# Altium project FX.PrjPcb
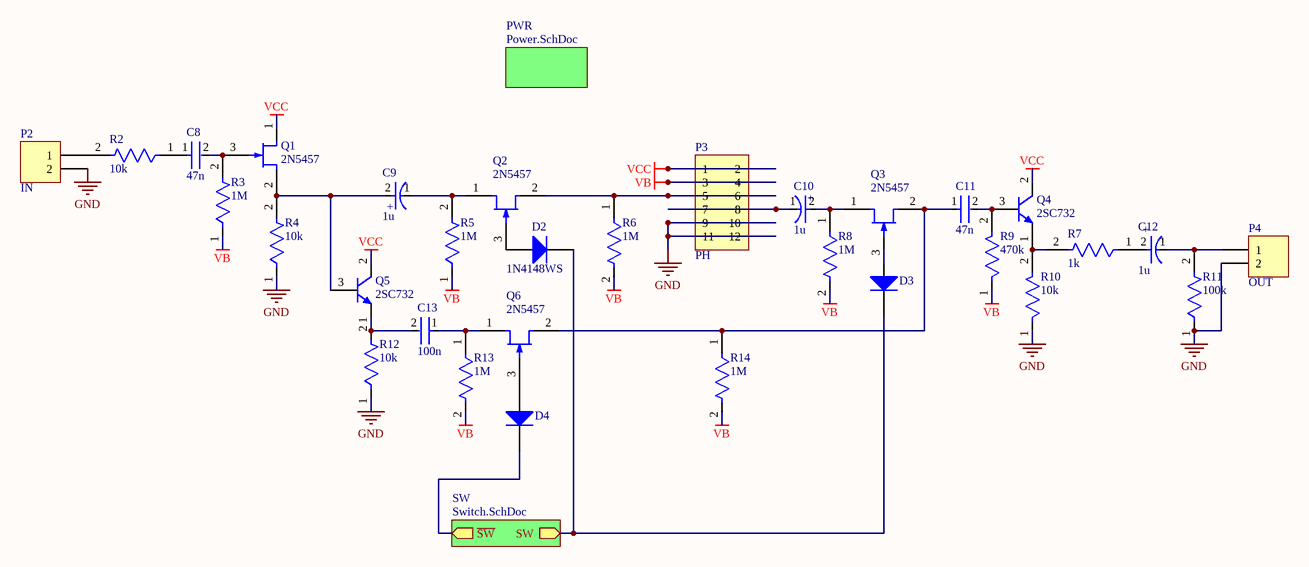
[diagram p0: Top_Level.SchDoc]
3 sheets, 72 parts. Net scope: hierarchical (ports join the sheet entries above them; power ports are global).
Board file: FX.PcbDoc
Sheets:
  Top_Level.SchDoc
    PWR = Power.SchDoc
    SW = Switch.SchDoc

## Sheet Top_Level.SchDoc
size A4

### Parts
C8  47n  [FP-CL10-IPC_A]
C9  1u  [FP-TAJA-MFG]
C10  1u  [FP-TAJA-MFG]
C11  47n  [FP-CL10-IPC_A]
C12  1u  [FP-TAJA-MFG]
C13  100n  [FP-CL10-IPC_A]
D2  1N4148WS  [DIOD-SOD323-2-A_V]
D3  1N4148WS  [DIOD-SOD323-2-A_V]  (value not drawn)
D4  1N4148WS  [DIOD-SOD323-2-A_V]  (value not drawn)
P2  IN  [HDR1X2]
P3  PH  [HDR2X6]
P4  OUT  [HDR1X2]
Q1  2N5457  [TO-92]
Q2  2N5457  [TO-92]
Q3  2N5457  [TO-92]
Q4  2SC732  [TO-92]
Q5  2SC732  [TO-92]
Q6  2N5457  [TO-92]
R2  10k  [FP-RT0805-MFG]
R3  1M  [FP-RT0805-MFG]
R4  10k  [FP-RT0805-MFG]
R5  1M  [FP-RT0805-MFG]
R6  1M  [FP-RT0805-MFG]
R7  1k  [FP-RT0805-MFG]
R8  1M  [FP-RT0805-MFG]
R9  470k  [FP-RT0805-MFG]
R10  10k  [FP-RT0805-MFG]
R11  100k  [FP-RT0805-MFG]
R12  10k  [FP-RT0805-MFG]
R13  1M  [FP-RT0805-MFG]
R14  1M  [FP-RT0805-MFG]

### Sub-sheets
PWR = Power.SchDoc: no entries
SW = Switch.SchDoc: ~{SW} (out), SW (out)

### Nets
GND: P2.2 P3.9 P3.10 P3.11 P3.12 P4.2 R4.1 R10.1 R11.1 R12.1
VB: P3.3 P3.4 R3.1 R5.1 R6.2 R8.2 R9.1 R13.2 R14.2
VCC: P3.1 P3.2 Q1.1(D) Q4.2(C) Q5.2(C)
NetC8_1: C8.1 R2.1
NetC8_2: C8.2 Q1.3(G) R3.2
NetC9_1: C9.1(C) Q2.1(D) R5.2
NetC9_2: C9.2(A) Q1.2(S) Q5.3(B) R4.2
NetC10_1: C10.1(C) P3.7 P3.8
NetC10_2: C10.2(A) Q3.1(D) R8.1
NetC11_1: C11.1 Q3.2(S) Q6.2(S) R14.1
NetC11_2: C11.2 Q4.3(B) R9.2
NetC12_1: C12.1(C) P4.1 R11.2
NetC12_2: C12.2(A) R7.1
NetC13_1: C13.1 Q6.1(D) R13.1
NetC13_2: C13.2 Q5.1(E) R12.2
NetC16_2: D2.2(K) D3.2(K) ; sheet SW/SW
NetC19_2: D4.2(K) ; sheet SW/~{SW}
NetD2_1: D2.1(A) Q2.3(G)
NetD3_1: D3.1(A) Q3.3(G)
NetD4_1: D4.1(A) Q6.3(G)
NetP2_1: P2.1 R2.2
NetP3_5: P3.5 P3.6 Q2.2(S) R6.1
NetQ4_1: Q4.1(E) R7.2 R10.2

### Notes on the sheet
- (in symbol CMP-1661-00004-2) +

### Library data of the parts
C8 C11 C13 = CMP-13271-004807-1: Cap Ceramic 1nF 50V C0G ±5% Pad SMD 0603 +125°C T/R; Temperature Coefficient: 300ppm/°C; Voltage Rating (DC): 50V; Length: 1.6mm; Width: 0.031inch; Series: CL; Case Code (Imperial): 0603; Voltage: 50V; Lead Free: Lead Free; Packaging: Tape and Reel; Dielectric: C0G; Material: Ceramic; Thickness: 0.035inch; Max Operating Temperature: 125°C; Package Quantity: 1; RoHS Compliant: Yes; Radiation Hardening: No; Capacitance: 1nF; Mount: Surface Mount; Voltage Rating: 50V; Height: 0.8mm; Tolerance: 5%; Min Operating Temperature: -55°C; Case Code (Metric): 1608; Case/Package: 0603; Depth: 0.8mm
C9 C10 C12 = CMP-1661-00004-2: 10uF 16V  ±10% 3Ω 1206  SMD Tantalum Capacitor; ESR (Equivalent Series Resistance): 3R; Leakage Current: 1.6uA; Dissipation Factor: 8%; Polarity: Polar; Length: 3.2mm; Features: General Purpose; Voltage Rating: 16V; Voltage: 16V; Mount: Surface Mount; Case/Package: 1206; Number of Pins: 2; Case Code (Metric): 3216; Radiation Hardening: No; Min Operating Temperature: -55°C; Case Code (Imperial): 1206; Height - Seated (Max): 0.071inch; Lead Free: Lead Free; Termination: SMD/SMT; Dielectric Material: Tantalum; Width: 1.6mm; Tolerance: 10%; Capacitance: 10uF; Lead Pitch: 1.1mm; Max Operating Temperature: 125°C; Voltage Rating (DC): 16V; Packaging: Tape and Reel; Package Quantity: 1; REACH SVHC: No SVHC; Depth: 1.6mm; Height: 1.6mm
D2-D4 = CMP-1667-00004-1: Fast Switching Diode, 75 V, 0.3 A, -65 to 150 degC, 2-Pin SOD323, RoHS, Tape and Reel; DatasheetVersion: Rev. 25-2, 03/2016; PackageDescription: 2-Pin Small Outline Diode, Body 1.7 x 1.3 mm; ComponentLink2Description: Datasheet; ComponentLink1URL: http://www.diodes.com/; PackageReference: SOD323-2; ComponentLink2URL: http://www.diodes.com/datasheets/ds30097.pdf; ComponentLink1Description: Manufacturer URL
P2 P4 = Header 2: Header, 2-Pin; LatestRevisionDate: 17-Jul-2002; LatestRevisionNote: Re-released for DXP Platform.; Publisher: Altium Limited
P3 = Header 6X2: Header, 6-Pin, Dual row; LatestRevisionDate: 17-Jul-2002; LatestRevisionNote: Re-released for DXP Platform.; Publisher: Altium Limited
Q1-Q3 Q6 = JFET_NPN
Q4 Q5 = BJT_NPN
R2-R14 = CMP-2001-01759-2: RES SMD 10K OHM 0.1% 1/8W 0805; Manufacturer Part Number: RT0805BRE0710KL; Manufacturer: Yageo; Voltage Rating: 150V; Resistance: 10KΩ; Tolerance: 0.0025; Temperature Coefficient: 50 ppm/°C; Power Rating: 0.125W; Value: 10KΩ; Temperature Range Low: -55°C; Device Class L2: Resistors; RoHS: TRUE; Series: RT; Device Class L1: Passive Components; Ipc Land Pattern Name: RESC200125X50; Category: Res; Automotive: No; ComponentLink2Description: Datasheet; ComponentLink2URL: http://www.yageo.com/documents/recent/PYu-RT_1-to-0.01_RoHS_L_9.pdf; Digikey Description: RES SMD 10K OHM 0.1% 1/8W 0805; Package: RT0805; Device Class L3: Chip SMD Resistors; Octopart: https://octopart.com/rt0805bre0710kl-yageo-1239246; Temperature Range High: +155°C; Lead Free: Yes; Height: 0.6mm; Composition: Thin Film; Footprint Url: http://www.yageo.com/exep/pages/download/literatures/PYu-R_Mount_10.pdf; Temperature: -55°C to +155°C; Mouser Description: Thin Film Resistors 10K ohm 0.1% 1/8W

## Sheet Power.SchDoc
size A4
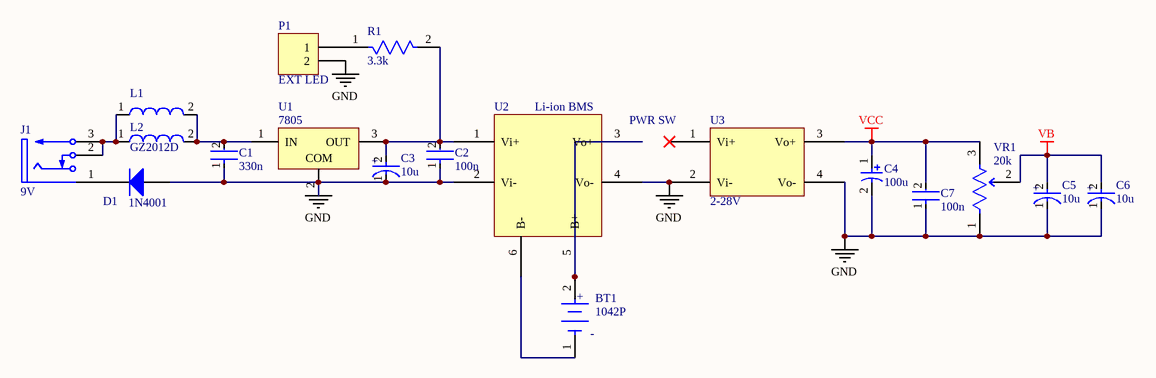
[diagram p1: Power.SchDoc]

### Parts
BT1  1042P  [FP-1042P-MFG]
C1  330n  [FP-CL10-IPC_A]
C2  100n  [FP-CL10-IPC_A]
C3  10u  [FP-TAJA-MFG]
C4  100u  [EL_5X11_RA]
C5  10u  [FP-TAJA-MFG]
C6  10u  [FP-TAJA-MFG]
C7  100n  [FP-CL10-IPC_A]
D1  1N4001  [DO-41]
J1  9V  [SWITCH-RAPC712X-3_V]
L1  GZ2012D  [SMD-0805]  (value not drawn)
L2  GZ2012D  [SMD-0805]
P1  EXT LED  [HDR1X2]
R1  3.3k  [FP-RT0805-MFG]
U1  7805  [TO-220_H]
U2  Li-ion BMS  [BMS]
U3  2-28V  [BOOST]
VR1  20k  [TRIM_6_TOP]

### Nets
GND: C1.1 C2.1 C3.1(C) C4.2 C5.1(C) C6.1(C) C7.1 D1.1(A) P1.2 U1.2(COM) U2.2(Vi-) U2.4(Vo-) U3.2(Vi-) U3.4(Vo-) VR1.1(CCW)
VB: C5.2(A) C6.2(A) VR1.2(WIPER)
VCC: C4.1 C7.2 U3.3(Vo+) VR1.3(CW)
NetBT1_1: BT1.1(C) U2.6(B-)
NetBT1_2: BT1.2(A) U2.3(Vo+) U2.5(B+)
NetC1_2: C1.2 L1.2 L2.2 U1.1(IN)
NetC2_2: C2.2 C3.2(A) R1.2 U1.3(OUT) U2.1(Vi+)
NetD1_2: D1.2(K) J1.1
NetJ1_2: J1.2 J1.3 L1.1 L2.1
NetP1_1: P1.1 R1.1

Not connected (* = marked no-connect by the designer): U3 1(Vi+)*

### Notes on the sheet
- PWR SW
- (in symbol CMP-1661-00004-2) +
- (in symbol CMP-19636-000019-1) +; -

### Library data of the parts
BT1 = CMP-19636-000019-1: BATTERY HOLDER 18650 SMD TAB; Number of Cells: 1; Max Operating Temperature: 145°C; Termination: SMD/SMT; Mount: Surface Mount; Min Operating Temperature: -50°C; Package Quantity: 200; Packaging: Tray; Lead Free: Lead Free
C1 C2 C7 = CMP-13271-004807-1: as C8 on sheet Top_Level; Voltage Rating (DC): 50V; Length: 1.6mm; Width: 0.031inch; Series: CL; Case Code (Imperial): 0603; Voltage: 50V; Lead Free: Lead Free; Packaging: Tape and Reel; Dielectric: C0G; Material: Ceramic; Thickness: 0.035inch; Max Operating Temperature: 125°C; Package Quantity: 1; RoHS Compliant: Yes; Radiation Hardening: No; Capacitance: 1nF; Mount: Surface Mount; Voltage Rating: 50V; Height: 0.8mm; Tolerance: 5%; Min Operating Temperature: -55°C; Case Code (Metric): 1608; Case/Package: 0603; Depth: 0.8mm
C3 C5 C6 = CMP-1661-00004-2: as C9 on sheet Top_Level; Length: 3.2mm; Features: General Purpose; Voltage Rating: 16V; Voltage: 16V; Mount: Surface Mount; Case/Package: 1206; Number of Pins: 2; Case Code (Metric): 3216; Radiation Hardening: No; Min Operating Temperature: -55°C; Case Code (Imperial): 1206; Height - Seated (Max): 0.071inch; Lead Free: Lead Free; Termination: SMD/SMT; Dielectric Material: Tantalum; Width: 1.6mm; Tolerance: 10%; Capacitance: 10uF; Lead Pitch: 1.1mm; Max Operating Temperature: 125°C; Voltage Rating (DC): 16V; Packaging: Tape and Reel; Package Quantity: 1; REACH SVHC: No SVHC; Depth: 1.6mm; Height: 1.6mm
C4 = CAP_POL
D1 = DIODE_SW
J1 = CMP-2000-05384-1: Power Jack, 5 A, 3-Pin THD, RoHS, Bulk; Manufacturer: Switchcraft; Current Rating: 5A; Plug/Mating Plug Diameter: 2.1mmID,5.5mmOD; Gender: Male; Mating Products: S765-ND / -CONNPLUGMINIPWR2CONDWHT/RED / S760K-ND / -CONNPOWERPLUGMINI.08"BLACK / SC1052-ND / -CONNPOWERPLUGMINIBLACK; Number of Positions/Contacts: 2Conductors,2Contacts; Internal Switch(s): SingleSwitch,NormallyClosed; Shielding: Unshielded; Catalog Drawings: RAPC7(1,2)2XSide / RAPC7(1,2)2XTop; Dynamic Catalog: SwitchcraftInc; Other Names: Q2287470A / RAPC722X-ND / SC1313; Standard Package: 2,500; Termination: SolderEyelet(s); Family: Barrel-PowerConnectors; Housing Color: Black; Housing Material: Thermoplastic; RoHS Information: SwitchcraftRoHSInfo; Color: Black; Contact Material - Plating: Nickel; Mounting Type: ThroughHole,RightAngle; Manufacturer URL: http://www.switchcraft.com/; Contact Material: Brass; Datasheet Version: Rev. A, 08/2005; Connector Type: Jack; Category: Connectors,Interconnects; Datasheet URL: http://www.mouser.com/ds/2/393/rapc722x_cd-371352.pdf
L1 L2 = CMP-0220-00037-1: SMD EMI Suppression Ferrite Bead WE-CBF, Z = 1000 Ohm; ComponentLink2Description: Datasheet; PackageVersion: 2005; ComponentLink1URL: http://www.we-online.com; PackageDescription: Chip Inductor, 2-Leads, Body 2.0 x 1.2 mm; DatasheetVersion: Dec-2005; ComponentLink1Description: Manufacturer Link; Impedance: 1000 Ohm; PackageReference: SMD-0805; ComponentLink2URL: http://www.we-online.de/katalog/media/pdf/74279205.pdf
P1 = Header 2: Header, 2-Pin; LatestRevisionDate: 17-Jul-2002; LatestRevisionNote: Re-released for DXP Platform.; Publisher: Altium Limited
R1 = CMP-2001-01759-2: as R2 on sheet Top_Level; Temperature Range Low: -55°C; Device Class L2: Resistors; RoHS: TRUE; Series: RT; Device Class L1: Passive Components; Ipc Land Pattern Name: RESC200125X50; Category: Res; Automotive: No; ComponentLink2Description: Datasheet; ComponentLink2URL: http://www.yageo.com/documents/recent/PYu-RT_1-to-0.01_RoHS_L_9.pdf; Digikey Description: RES SMD 10K OHM 0.1% 1/8W 0805; Package: RT0805; Device Class L3: Chip SMD Resistors; Octopart: https://octopart.com/rt0805bre0710kl-yageo-1239246; Temperature Range High: +155°C; Lead Free: Yes; Height: 0.6mm; Composition: Thin Film; Footprint Url: http://www.yageo.com/exep/pages/download/literatures/PYu-R_Mount_10.pdf; Temperature: -55°C to +155°C; Mouser Description: Thin Film Resistors 10K ohm 0.1% 1/8W
U2 = BMS
U3 = BOOST
VR1 = TRIM

## Sheet Switch.SchDoc
size A4
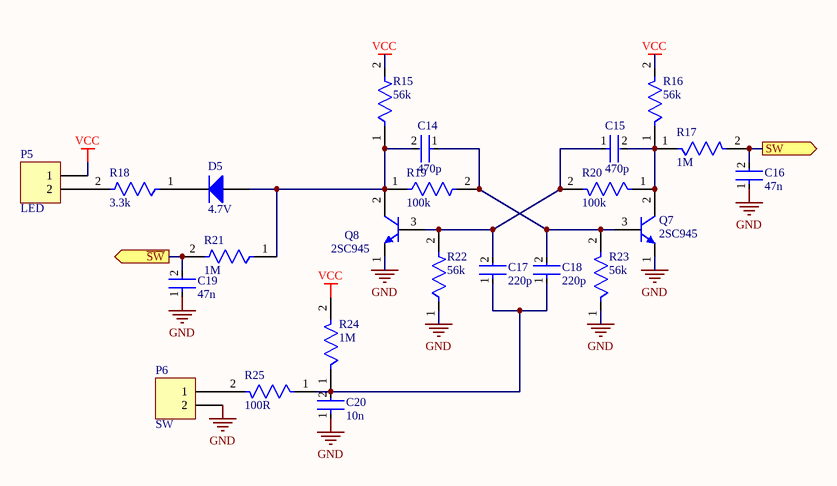
[diagram p2: Switch.SchDoc]

### Parts
C14  470p  [FP-CL10-IPC_A]
C15  470p  [FP-CL10-IPC_A]
C16  47n  [FP-CL10-IPC_A]
C17  220p  [FP-CL10-IPC_A]
C18  220p  [FP-CL10-IPC_A]
C19  47n  [FP-CL10-IPC_A]
C20  10n  [FP-CL10-IPC_A]
D5  4.7V  [DO-41]
P5  LED  [HDR1X2]
P6  SW  [HDR1X2]
Q7  2SC945  [TO-92]
Q8  2SC945  [TO-92]
R15  56k  [FP-RT0805-MFG]
R16  56k  [FP-RT0805-MFG]
R17  1M  [FP-RT0805-MFG]
R18  3.3k  [FP-RT0805-MFG]
R19  100k  [FP-RT0805-MFG]
R20  100k  [FP-RT0805-MFG]
R21  1M  [FP-RT0805-MFG]
R22  56k  [FP-RT0805-MFG]
R23  56k  [FP-RT0805-MFG]
R24  1M  [FP-RT0805-MFG]
R25  100R  [FP-RT0805-MFG]

### Ports
SW (out), ~{SW} (out)

### Nets
GND: C16.1 C19.1 C20.1 P6.2 Q7.1(E) Q8.1(E) R22.1 R23.1
VCC: P5.1 R15.2 R16.2 R24.2
NetC14_1: C14.1 C18.2 Q7.3(B) R19.2 R23.2
NetC14_2: C14.2 D5.1(A) Q8.2(C) R15.1 R19.1 R21.1
NetC15_1: C15.1 C17.2 Q8.3(B) R20.2 R22.2
NetC15_2: C15.2 Q7.2(C) R16.1 R17.1 R20.1
NetC16_2: C16.2 R17.2 ; port SW
NetC17_1: C17.1 C18.1 C20.2 R24.1 R25.1
NetC19_2: C19.2 R21.2 ; port ~{SW}
NetD5_2: D5.2(K) R18.1
NetP5_2: P5.2 R18.2
NetP6_1: P6.1 R25.2

### Library data of the parts
C14-C20 = CMP-13271-004807-1: as C8 on sheet Top_Level; Voltage Rating (DC): 50V; Length: 1.6mm; Width: 0.031inch; Series: CL; Case Code (Imperial): 0603; Voltage: 50V; Lead Free: Lead Free; Packaging: Tape and Reel; Dielectric: C0G; Material: Ceramic; Thickness: 0.035inch; Max Operating Temperature: 125°C; Package Quantity: 1; RoHS Compliant: Yes; Radiation Hardening: No; Capacitance: 1nF; Mount: Surface Mount; Voltage Rating: 50V; Height: 0.8mm; Tolerance: 5%; Min Operating Temperature: -55°C; Case Code (Metric): 1608; Case/Package: 0603; Depth: 0.8mm
D5 = DIODE_SW
P5 P6 = Header 2: Header, 2-Pin; LatestRevisionDate: 17-Jul-2002; LatestRevisionNote: Re-released for DXP Platform.; Publisher: Altium Limited
Q7 Q8 = BJT_NPN
R15-R25 = CMP-2001-01759-2: as R2 on sheet Top_Level; Temperature Range Low: -55°C; Device Class L2: Resistors; RoHS: TRUE; Series: RT; Device Class L1: Passive Components; Ipc Land Pattern Name: RESC200125X50; Category: Res; Automotive: No; ComponentLink2Description: Datasheet; ComponentLink2URL: http://www.yageo.com/documents/recent/PYu-RT_1-to-0.01_RoHS_L_9.pdf; Digikey Description: RES SMD 10K OHM 0.1% 1/8W 0805; Package: RT0805; Device Class L3: Chip SMD Resistors; Octopart: https://octopart.com/rt0805bre0710kl-yageo-1239246; Temperature Range High: +155°C; Lead Free: Yes; Height: 0.6mm; Composition: Thin Film; Footprint Url: http://www.yageo.com/exep/pages/download/literatures/PYu-R_Mount_10.pdf; Temperature: -55°C to +155°C; Mouser Description: Thin Film Resistors 10K ohm 0.1% 1/8W

## Nets that join several sheets
GND: Top_Level (10 pins), Power (15 pins), Switch (8 pins)
VB: Top_Level (9 pins), Power (C5.2 C6.2 VR1.2)
VCC: Top_Level (5 pins), Power (C4.1 C7.2 U3.3 VR1.3), Switch (P5.1 R15.2 R16.2 R24.2)
NetC16_2: Top_Level (D2.2 D3.2), Switch (C16.2 R17.2)
NetC19_2: Top_Level (D4.2), Switch (C19.2 R21.2)